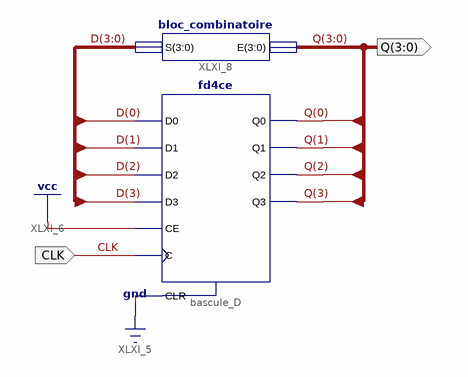
[diagram p0: schematic sheet 1]
// Xilinx ISE schematic compteur_decade.sch (spartan3e) as structural Verilog: 2 symbols, 2 ports
module compteur_decade (
  input  CLK,
  output [3:0] Q
);

  wire [3:0] D;

  fd4ce bascule_D (
    .C(CLK), .CE(1'b1), .CLR(1'b0), .D0(D[0]), .D1(D[1]), .D2(D[2]), .D3(D[3]), .Q0(Q[0]), .Q1(Q[1]),
    .Q2(Q[2]), .Q3(Q[3]));
  bloc_combinatoire XLXI_8 (.E(Q), .S(D));
endmodule
